# Altium schematic sheet LEDmainb.SchDoc
size C; PageSetup: Record=PageOptions|CenterHorizontal=True|CenterVertical=True|PrintScale=0.77|XCorrection=1.00|YCorrection=1.00|PrintKind=1|BorderSize=5000000|LeftOffset=0|BottomOffset=0|Orientation=2|PaperLength=1000|PaperWidth=1000|Scale=100|PaperSource=15|PrintQuality=1200|MediaType=1|DitherType=10|PrintScaleMode=1|PaperKind=A3|PaperIndex=8
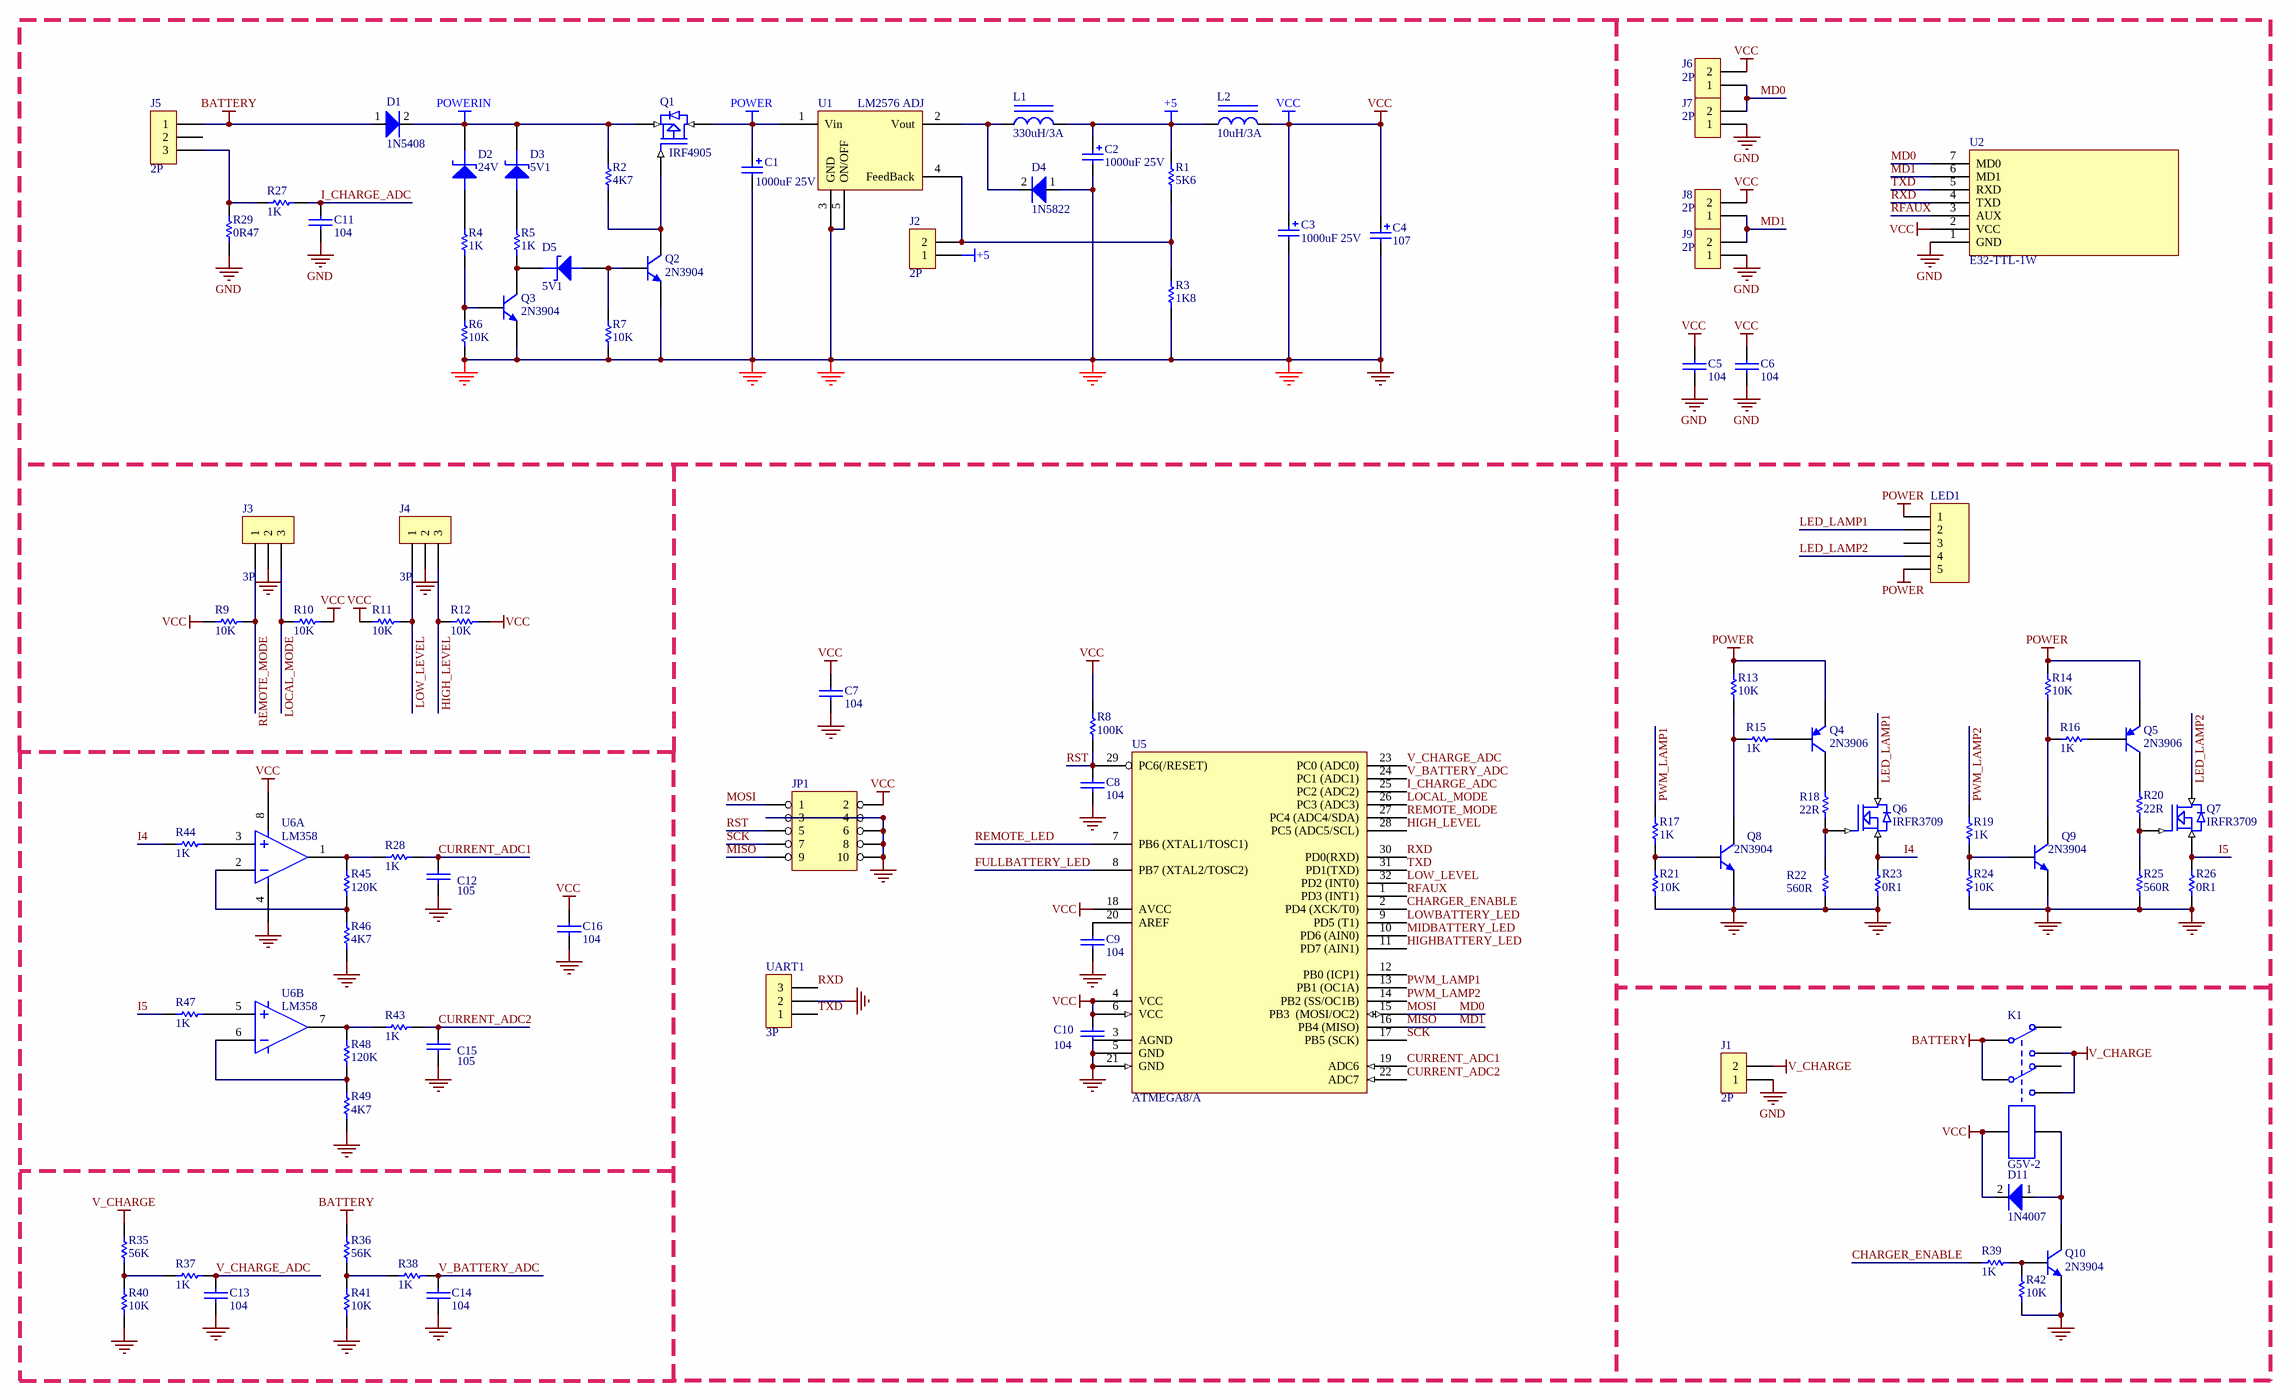
[diagram p0: LEDmainb.SchDoc]

## Parts
C1  value 1000uF 25V  [CAP40x20L]
C2  value 1000uF 25V  [CAP40x20L]
C3  value 1000uF 25V  [CAP40x20L]
C4  value 107  [SMC_E/WA]
C5  value 104  [0805C]
C6  value 104  [0805C]
C7  value 104  [0805C]
C8  value 104  [0805C]
C9  value 104  [0805C]
C10  value 104  [0805C]
C11  value 104  [0805C]
C12  value 105  [0805C]
C13  value 104  [0805C]
C14  value 104  [0805C]
C15  value 105  [0805C]
C16  value 104  [0805C]
D1  value 1N5408  [1N5408]
D2  value 24V  [1N4148_S]
D3  value 5V1  [1N4148_S]
D4  value 1N5822  [1N5822]
D5  value 5V1  [1N4148_S]
D11  value 1N4007  [DIODE1A]
J1  value 2P  [JACK381_2]
J2  value 2P  [XPAD]
J3  value 3P  [HDR1x3]
J4  value 3P  [HDR1x3]
J5  value 2P  [JACK381_3]
J6  value 2P  [XPAD]
J7  value 2P  [XPAD]
J8  value 2P  [XPAD]
J9  value 2P  [XPAD]
JP1  Jump đực chân thẳng, 2 hàng chân 2.54mm 10P  [HDR2X5]  (value not drawn)
K1  value G5V-2  [RELAY]
L1  value 330uH/3A  [CAMTRONDUNG]
L2  value 10uH/3A  [CAMTRONDUNG]
LED1  JUMP đực chân thẳng, 2.54mm 5P  [HDR1X5]  (value not drawn)
Q1  value IRF4905  [TO220SMD]
Q2  value 2N3904  [SOT23S]
Q3  value 2N3904  [SOT23S]
Q4  value 2N3906  [SOT23S]
Q5  value 2N3906  [SOT23S]
Q6  value IRFR3709  [TO220HSMD]
Q7  value IRFR3709  [TO220HSMD]
Q8  value 2N3904  [SOT23S]
Q9  value 2N3904  [SOT23S]
Q10  value 2N3904  [SOT23S]
R1  value 5K6  [0805DD]
R2  value 4K7  [0805DD]
R3  value 1K8  [0805DD]
R4  value 1K  [0805DD]
R5  value 1K  [0805DD]
R6  value 10K  [0805DD]
R7  value 10K  [0805DD]
R8  value 100K  [0805DD]
R9  value 10K  [0805DD]
R10  value 10K  [0805DD]
R11  value 10K  [0805DD]
R12  value 10K  [0805DD]
R13  value 10K  [0805DD]
R14  value 10K  [0805DD]
R15  value 1K  [0805DD]
R16  value 1K  [0805DD]
R17  value 1K  [0805DD]
R18  value 22R  [0805DD]
R19  value 1K  [0805DD]
R20  value 22R  [0805DD]
R21  value 10K  [0805DD]
R22  value 560R  [0805DD]
R23  value 0R1  [AXIAL0.8S]
R24  value 10K  [0805DD]
R25  value 560R  [0805DD]
R26  value 0R1  [AXIAL0.8S]
R27  value 1K  [0805DD]
R28  value 1K  [0805DD]
R29  value 0R47  [AXIAL0.8S]
R35  value 56K  [0805DD]
R36  value 56K  [0805DD]
R37  value 1K  [0805DD]
R38  value 1K  [0805DD]
R39  value 1K  [0805DD]
R40  value 10K  [0805DD]
R41  value 10K  [0805DD]
R42  value 10K  [0805DD]
R43  value 1K  [0805DD]
R44  value 1K  [0805DD]
R45  value 120K  [0805DD]
R46  value 4K7  [0805DD]
R47  value 1K  [0805DD]
R48  value 120K  [0805DD]
R49  value 4K7  [0805DD]
U1  value LM2576 ADJ  [TO220_5CSMD2]
U2  value E32-TTL-1W  [RF_AS32]
U5  value ATMEGA8/A  [ATMEGA8]
U6  Name: LM358  [so-8]  (hidden comment: IC khuếch đại thuật toán LM358 chân dán SO-8)  (parts A,B of 2)
UART1  value 3P  [HDR1x3]

## Nets
+5: C2.1 J2.1 L1.2 L2.1 R1.2
BATTERY: D1.1(A) J5.1 K1.1 K1.4 R36.2
GND: C1.2 C2.2 C3.2 C4.2 C5.2 C6.1 C7.1 C8.2 C9.1 C10.1 C11.2 C12.2 C13.2 C14.2 C15.2 C16.1 D4.1(A) J1.1 J3.2 J4.2 J7.1 J9.1 JP1.3 JP1.4 JP1.6 JP1.8 JP1.10 Q2.3(E) Q3.3(E) Q8.3(E) Q9.3(E) Q10.3(E) R3.1 R6.1 R7.1 R21.1 R22.2 R23.1 R24.1 R25.2 R26.1 R29.1 R40.1 R41.1 R42.1 R46.1 R49.2 U1.3(GND) U1.5(ON/OFF) U2.1(GND) U5.3(AGND) U5.5(GND) U5.21(GND) U6.4 UART1.2
POWER: C1.1 LED1.1 LED1.5 Q1.2(D) Q4.3(E) Q5.3(E) R13.2 R14.2 U1.1(Vin)
POWERIN: D1.2(K) D2.2(K) D3.2(K) Q1.3(S) R2.2
V_CHARGE: J1.2 K1.3 K1.6 R35.2
VCC: C3.1 C4.1 C5.1 C6.2 C7.2 C10.2 C16.2 D11.2(K) J6.2 J8.2 JP1.2 K1.7 L2.2 R8.2 R9.2 R10.2 R11.1 R12.1 U2.2(VCC) U5.4(VCC) U5.6(VCC) U5.18(AVCC) U6.8
CHARGER_ENABLE: R39.2 U5.2(PD4_(XCK/T0))
CURRENT_ADC1: C12.1 R28.1 U5.19(ADC6)
CURRENT_ADC2: C15.1 R43.1 U5.22(ADC7)
FULLBATTERY_LED: U5.8(PB7_(XTAL2/TOSC2))
HIGH_LEVEL: J4.3 R12.2 U5.28(PC5_(ADC5/SCL))
HIGHBATTERY_LED: U5.11(PD7_(AIN1))
I4: Q6.3(S) R23.2 R44.1
I5: Q7.3(S) R26.2 R47.1
I_CHARGE_ADC: C11.1 R27.2 U5.25(PC2_(ADC2))
LED_LAMP1: LED1.2 Q6.2(D)
LED_LAMP2: LED1.4 Q7.2(D)
LOCAL_MODE: J3.3 R10.1 U5.26(PC3_(ADC3))
LOW_LEVEL: J4.1 R11.2 U5.32(PD2_(INT0))
LOWBATTERY_LED: U5.9(PD5_(T1))
MD0: J6.1 J7.2 JP1.1 U2.7(MD0) U5.15(PB3__(MOSI/OC2))  [also labelled MOSI]
MD1: J8.1 J9.2 JP1.9 U2.6(MD1) U5.16(PB4_(MISO))  [also labelled MISO]
MIDBATTERY_LED: U5.10(PD6_(AIN0))
PWM_LAMP1: R17.1 U5.13(PB1_(OC1A))
PWM_LAMP2: R19.1 U5.14(PB2_(SS/OC1B))
REMOTE_LED: U5.7(PB6_(XTAL1/TOSC1))
REMOTE_MODE: J3.1 R9.1 U5.27(PC4_(ADC4/SDA))
RFAUX: U2.3(AUX) U5.1(PD3_(INT1))
RST: C8.1 JP1.5 R8.1 U5.29(PC6(/RESET))
RXD: U2.4(TXD) U5.30(PD0(RXD)) UART1.3
SCK: JP1.7 U5.17(PB5_(SCK))
TXD: U2.5(RXD) U5.31(PD1(TXD)) UART1.1
V_BATTERY_ADC: C14.1 R38.2 U5.24(PC1_(ADC1))
V_CHARGE_ADC: C13.1 R37.2 U5.23(PC0_(ADC0))
NetC9_2: C9.2 U5.20(AREF)
NetD2_1: D2.1(A) R4.2
NetD3_1: D3.1(A) R5.2
NetD4_2: D4.2(K) L1.1 U1.2(Vout)
NetD5_1: D5.1(A) Q2.1(B) R7.2
NetD5_2: D5.2(K) Q3.2(C) R5.1
NetD11_1: D11.1(A) K1.8 Q10.2(C)
NetJ2_2: J2.2 R1.1 R3.2 U1.4(FeedBack)
NetJ5_3: J5.3 R27.1 R29.2
NetQ1_1: Q1.1(G) Q2.2(C) R2.1
NetQ3_1: Q3.1(B) R4.1 R6.2
NetQ4_1: Q4.1(B) R15.1
NetQ4_2: Q4.2(C) R18.1
NetQ5_1: Q5.1(B) R16.1
NetQ5_2: Q5.2(C) R20.1
NetQ6_1: Q6.1(G) R18.2 R22.1
NetQ7_1: Q7.1(G) R20.2 R25.1
NetQ8_1: Q8.1(B) R17.2 R21.2
NetQ8_2: Q8.2(C) R13.1 R15.2
NetQ9_1: Q9.1(B) R19.2 R24.2
NetQ9_2: Q9.2(C) R14.1 R16.2
NetQ10_1: Q10.1(B) R39.1 R42.2
NetR28_2: R28.2 R45.2 U6.1
NetR35_1: R35.1 R37.1 R40.2
NetR36_1: R36.1 R38.1 R41.2
NetR43_2: R43.2 R48.2 U6.7
NetR44_2: R44.2 U6.3
NetR45_1: R45.1 R46.2 U6.2
NetR47_2: R47.2 U6.5
NetR48_1: R48.1 R49.1 U6.6

Not connected (* = marked no-connect by the designer): J5 2; K1 2 5; LED1 3; U5 12(PB0_(ICP1))

## Library data of the parts
C1-C4 = Cap Pol1: Polarized Capacitor (Radial); Type1: Tụ hóa chân cắm; Type2: Tụ hóa chân dán; Published: *; LatestRevisionDate: *; LatestRevisionNote: *; PackageReference: *; Publisher: *
C5-C16 = CAP: Type1: Tụ điện dán 0805; Type2: Tụ điện chân cắm
D1 D4 D11 = DIODE: Type1: Diode xung chân cắm 3A; Type2: Diode chỉnh lưu chân cắm 1A; Type3: Diode chỉnh lưu chân cắm 3A
D2 D3 D5 = ZENER2: Zener Diode; Type1: Diode ổn áp zener chân cắm 1W; Type2: Diode ổn áp zener chân cắm 0.5W
J1 J2 J6-J9 = CON2: Type1: Giắc xanh loại nằm, 300V/16A - 5.08mm; Type2: Jump đực loại thẳng, 2.54mm; Type3: Jumper; Type4: Giắc xanh loại nằm, 300V/16A - 3.81mm
J3 J4 UART1 = CON3: Type1: Jack xanh loại nằm, 300V/16A - 5.08mm; Type2: Jump đực chân thẳng, 2.54mm; Type3: Jack xanh loại nằm, 300V/16A - 3.81mm
J5 = CON3: Type1: Jack xanh loại nằm, 300V/16A - 5.08mm; Type2: Jump đực chân thẳng, 2.54mm; Type3: Giắc xanh loại nằm, 300V/16A - 3.81mm
JP1 = HEADER 5X2
K1 = Relay-DPDT: Dual-Pole Dual-Throw Relay; Type1: Relay OMRON, 8 chân cắm; Published: *; LatestRevisionDate: *; LatestRevisionNote: *; PackageReference: *; Publisher: *; Type2: *
L1 L2 = INDUCTORSMALL: Type1: Cuộn cảm chân cắm lõi trụ; Type2: Cuộn cảm chân cắm lõi xuyến
LED1 = Header 5: Header, 5-Pin; LatestRevisionDate: 17-Jul-2002; LatestRevisionNote: Re-released for DXP Platform.; Publisher: Altium Limited
Q1 = MOSFET P: Type1: Transistor trường MOSFET P, chân dán TO-263; Type2: Transistor trường MOSFET P, chân cắm TO-220
Q2 Q3 Q8-Q10 = NPN: NPN Bipolar Transistor; Type1: Transistor BJT NPN, chân dán SOT-23; Type2: Transistor BJT NPN, chân cắm TO-92; Published: *; LatestRevisionDate: *; LatestRevisionNote: *; PackageReference: *; Publisher: *; Code_JEDEC: *
Q4 Q5 = PNP: PNP Bipolar Transistor; Type1: Transistor BJT PNP, chân dán SOT-23; Type2: Transistor BJT PNP, chân cắm TO-92; Published: *; LatestRevisionDate: *; LatestRevisionNote: *; PackageReference: *; Publisher: *; Code_JEDEC: *
Q6 Q7 = MOSFET N: Type1: Transistor trường MOSFET N, chân dán TO-263; Type2: Transistor trường MOSFET N, chân cắm TO-220
R1-R29 R37-R39 R42 R43 = Res Semi: Semiconductor Resistor; Type1: Điện trở dán 0805; Type2: Điện trở chân cắm 1/4W; Type3: Điện trở chân cắm 2W; Published: *; LatestRevisionDate: *; LatestRevisionNote: *; PackageReference: *; Publisher: *
R35 R36 R40 R41 = Res Semi: Semiconductor Resistor; Type1: Điện trở dán 0805 1%; Type2: Điện trở chân cắm 1/4W; Type3: Điện trở chân cắm 2W; Published: *; LatestRevisionDate: *; LatestRevisionNote: *; PackageReference: *; Publisher: *
R44 R47 = Res Semi: Semiconductor Resistor; Type1: Điện trở dán 0805; Type2: Điện trở chân cắm 1/4W; Type3: Điện trở chân cắm 2W; Type4: Điện trở dán 2512; Published: *; LatestRevisionDate: *; LatestRevisionNote: *; PackageReference: *; Publisher: *
R45 R46 R48 R49 = Res Semi: Semiconductor Resistor; Type1: Điện trở dán 0805 1%; Type2: Điện trở chân cắm 1/4W; Type3: Điện trở chân cắm 2W; Type4: Điện trở dán 2512; Published: *; LatestRevisionDate: *; LatestRevisionNote: *; PackageReference: *; Publisher: *
U1 = LM2576: Type1: IC chuyển đổi nguồn, chân dán; Type2: IC chuyển đổi nguồn, chân cắm
U2 = AS32-TTL-1W: Type1: Module thu phát không dây RF
U5 = ATMEGA8-A: TQFP package; Type1: Vi điều khiển ATMEL chân dán
U6 = 1458: Type2: IC khuếch đại thuật toán LM358 chân cắm DIP8; Type1: IC khuếch đại thuật toán LM358 chân dán SO-8